# EAGLE design ESC (EAGLE 5.11)
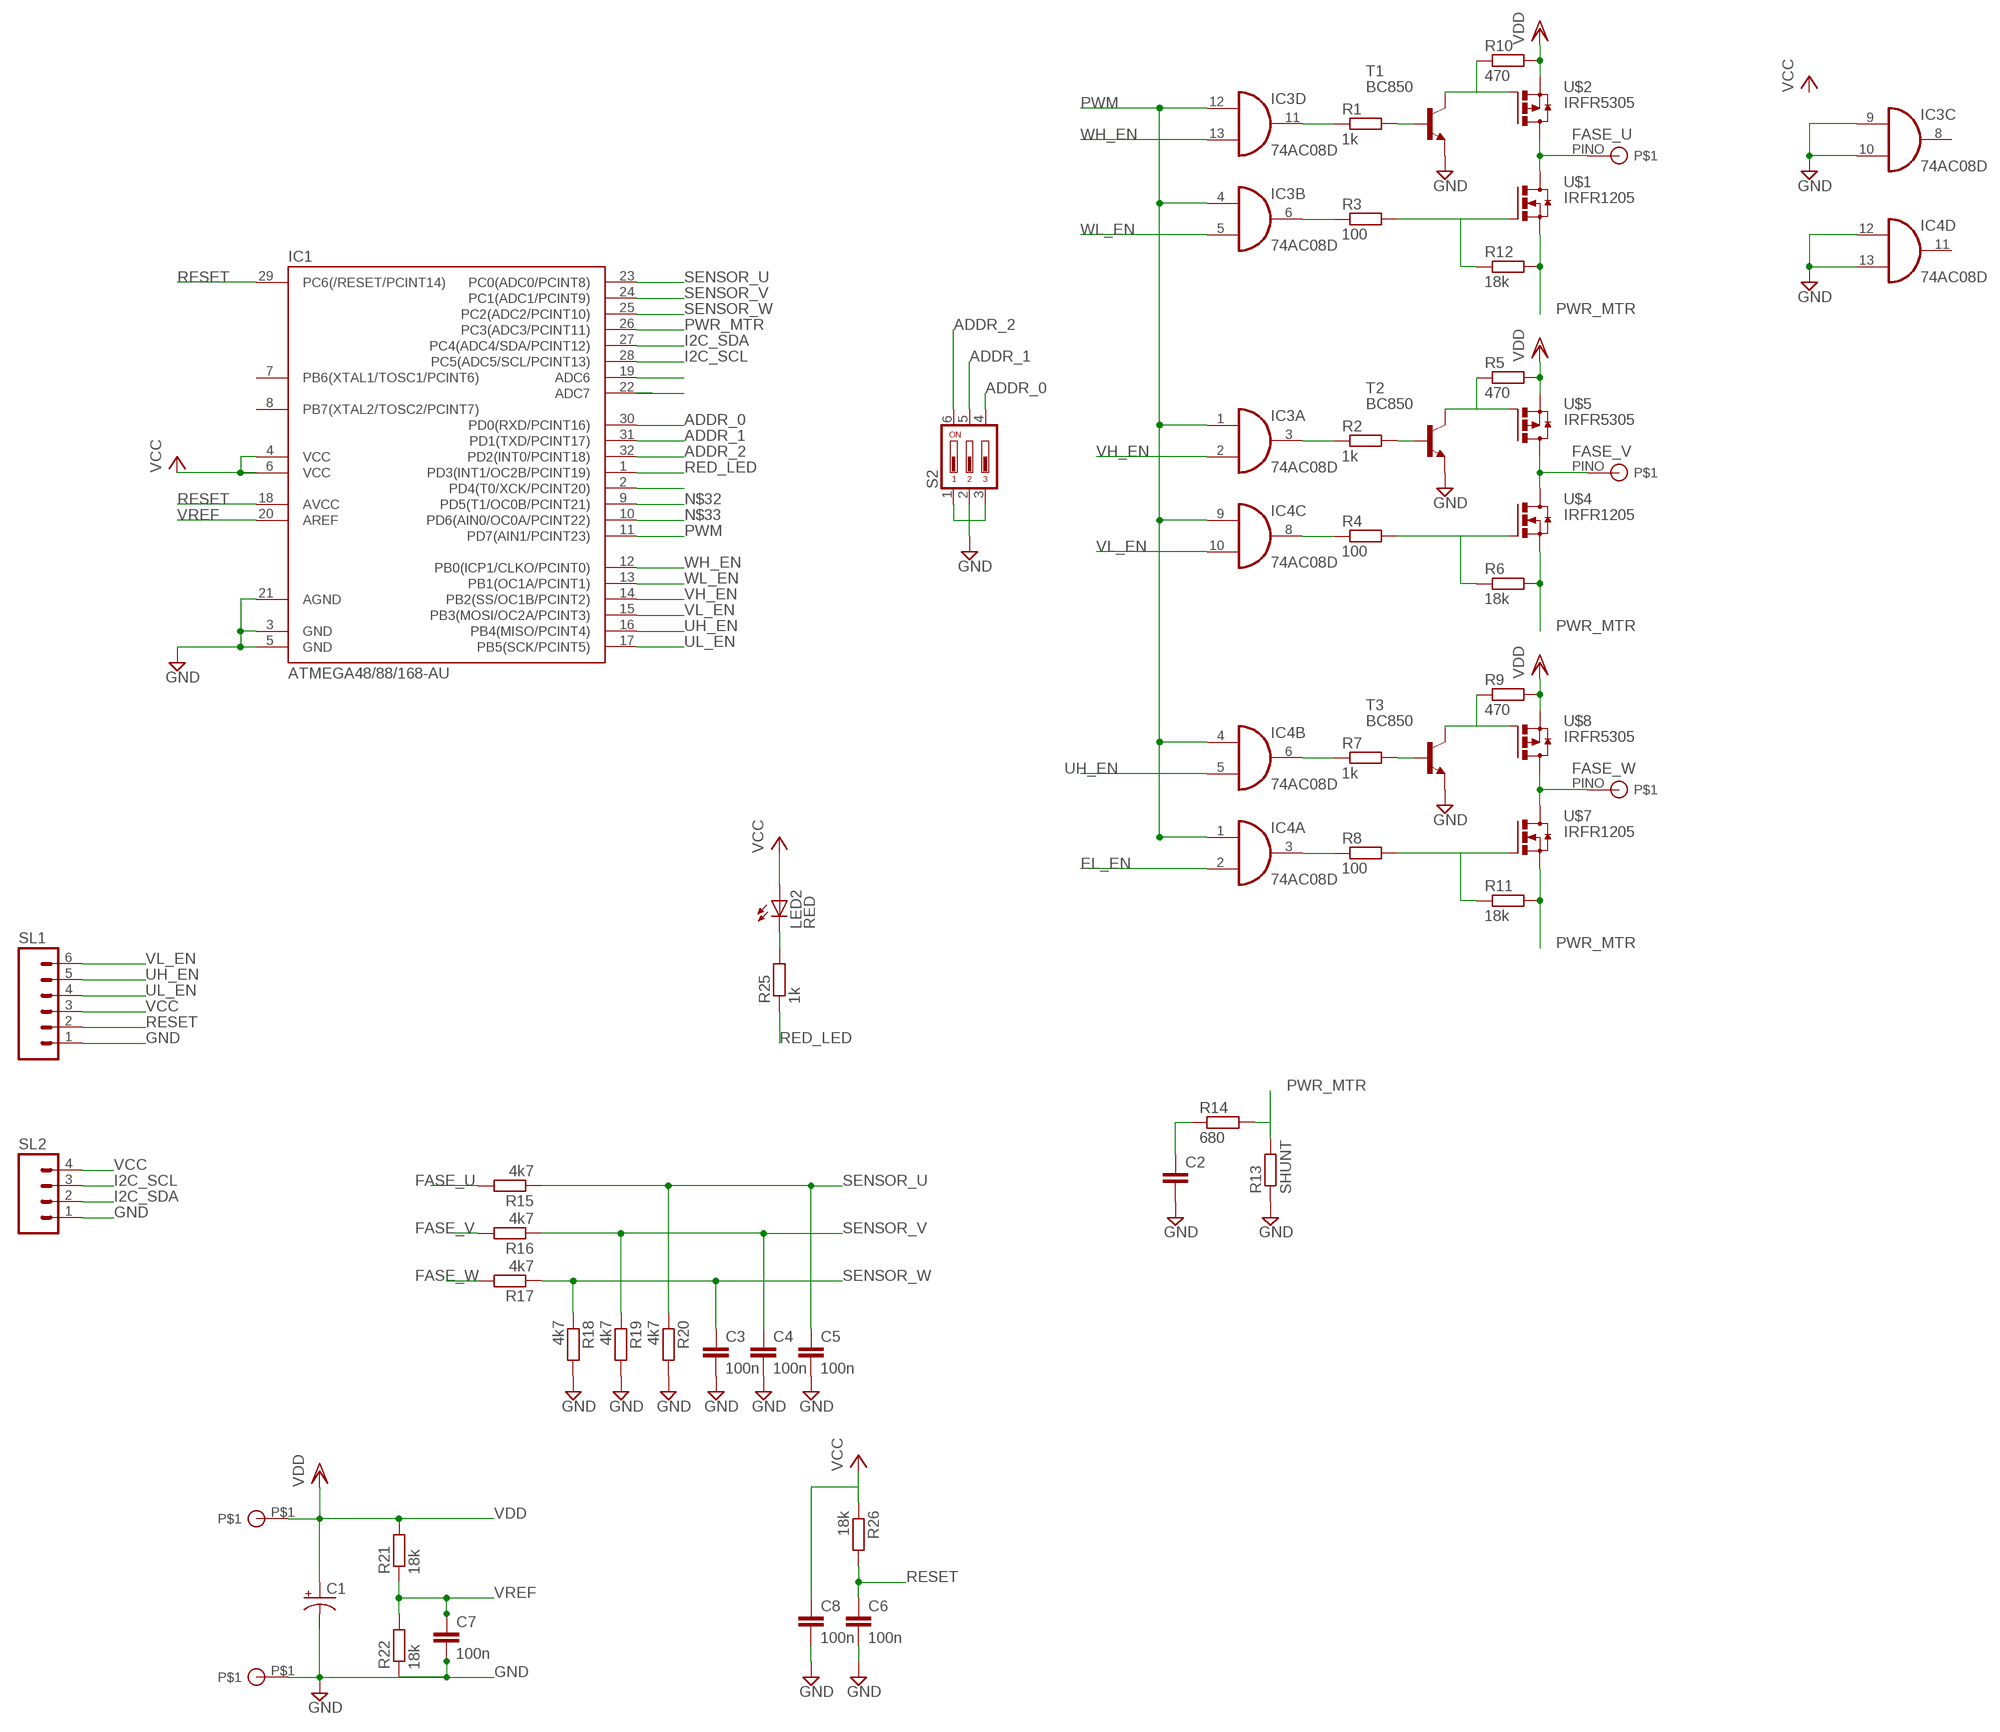
[diagram p0: schematic, sheet 1]

## Parts
BATTERY+  Battery+  BATTERY_CONNECTOR  [BATTERY_CONNECTOR]
C1  CPOL-USE5-8.5  [E5-8,5]
C2  C-EUC0805  [C0805]
C3  100n  C-EUC0805  [C0805]
C4  100n  C-EUC0805  [C0805]
C5  100n  C-EUC0805  [C0805]
C6  100n  C-EUC0805  [C0805]
C7  100n  C-EUC0805  [C0805]
C8  100n  C-EUC0805  [C0805]
IC1  ATMEGA48/88/168-AU  [TQFP32-08]
IC3  74AC08D  [SO14]
IC4  74AC08D  [SO14]
LED2  RED  LEDLSU260  [LSU260]
R1  1k  R-EU_R0805  [R0805]
R2  1k  R-EU_M0805  [M0805]
R3  100  R-EU_M0805  [M0805]
R4  100  R-EU_M0805  [M0805]
R5  470  R-EU_M0805  [M0805]
R6  18k  R-EU_M0805  [M0805]
R7  1k  R-EU_M0805  [M0805]
R8  100  R-EU_M0805  [M0805]
R9  470  R-EU_M0805  [M0805]
R10  470  R-EU_M0805  [M0805]
R11  18k  R-EU_M0805  [M0805]
R12  18k  R-EU_R0805  [R0805]
R13  SHUNT  R-EU_0204/2V  [0204V]
R14  680  R-EU_M0805  [M0805]
R15  4k7  R-EU_M0805  [M0805]
R16  4k7  R-EU_M0805  [M0805]
R17  4k7  R-EU_M0805  [M0805]
R18  4k7  R-EU_M0805  [M0805]
R19  4k7  R-EU_M0805  [M0805]
R20  4k7  R-EU_M0805  [M0805]
R21  18k  R-EU_M0805  [M0805]
R22  18k  R-EU_M0805  [M0805]
R25  1k  R-EU_R0805  [R0805]
R26  18k  R-EU_M0805  [M0805]
S2  DIP03YL  [DIP03YL]
SL1  M06  [06P]
SL2  M04  [04P]
T1  BC850  [SOT23]
T2  BC850  [SOT23]
T3  BC850  [SOT23]
U$1  IRFR1205  [DPAK]
U$2  IRFR5305  [DPAK]
U$3  MOTOR_CONNECTOR  [MOTOR_CONNECTOR]
U$4  IRFR1205  [DPAK]
U$5  IRFR5305  [DPAK]
U$6  MOTOR_CONNECTOR  [MOTOR_CONNECTOR]
U$7  IRFR1205  [DPAK]
U$8  IRFR5305  [DPAK]
U$9  MOTOR_CONNECTOR  [MOTOR_CONNECTOR]
U$11  BATTERY_CONNECTOR  [BATTERY_CONNECTOR]

## Nets
ADDR_0: IC1.30(PD0(RXD/PCINT16)) S2.4
ADDR_1: IC1.31(PD1(TXD/PCINT17)) S2.5
ADDR_2: IC1.32(PD2(INT0/PCINT18)) S2.6
EL_EN: IC4.2(A:I1)
FASE_U: R15.2 U$1.4(D) U$2.4(D) U$3.PINO
FASE_V: R16.2 U$4.4(D) U$5.4(D) U$6.PINO
FASE_W: R17.2 U$7.4(D) U$8.4(D) U$9.PINO
GND: C1.- C2.2 C3.2 C4.2 C5.2 C6.2 C7.2 C8.2 IC1.3(GND) IC1.5(GND) IC1.21(AGND) IC3.9(C:I0) IC3.10(C:I1) IC4.12(D:I0) IC4.13(D:I1) R13.1 R18.2 R19.2 R20.2 R22.1 S2.1 S2.2 S2.3 SL1.1 SL2.1 T1.2(E) T2.2(E) T3.2(E) U$11.P$1
I2C_SCL: IC1.28(PC5(ADC5/SCL/PCINT13)) SL2.3
I2C_SDA: IC1.27(PC4(ADC4/SDA/PCINT12)) SL2.2
N$1: R1.2 T1.1(B)
N$2: R10.1 T1.3(C) U$2.1(G)
N$3: R3.2 R12.1 U$1.1(G)
N$5: R2.2 T2.1(B)
N$6: R5.1 T2.3(C) U$5.1(G)
N$7: R4.2 R6.1 U$4.1(G)
N$8: LED2.K(C) R25.2
N$9: R7.2 T3.1(B)
N$10: R9.1 T3.3(C) U$8.1(G)
N$11: R8.2 R11.1 U$7.1(G)
N$12: IC3.11(D:O) R1.1
N$13: C2.1 R14.1
N$14: IC3.6(B:O) R3.1
N$15: IC3.3(A:O) R2.1
N$16: IC4.8(C:O) R4.1
N$17: IC4.6(B:O) R7.1
N$18: IC4.3(A:O) R8.1
N$25: IC1.19(ADC6)
N$26: IC1.22(ADC7)
N$31: IC1.2(PD4(T0/XCK/PCINT20))
N$32: IC1.9(PD5(T1/OC0B/PCINT21))
N$33: IC1.10(PD6(AIN0/OC0A/PCINT22))
PWM: IC1.11(PD7(AIN1/PCINT23)) IC3.1(A:I0) IC3.4(B:I0) IC3.12(D:I0) IC4.1(A:I0) IC4.4(B:I0) IC4.9(C:I0)
PWR_MTR: IC1.26(PC3(ADC3/PCINT11)) R6.2 R11.2 R12.2 R13.2 R14.2 U$1.3(S) U$4.3(S) U$7.3(S)
RED_LED: IC1.1(PD3(INT1/OC2B/PCINT19)) R25.1
RESET: C6.1 IC1.29(PC6(/RESET/PCINT14)) R26.2 SL1.2
SENSOR_U: C5.1 IC1.23(PC0(ADC0/PCINT8)) R15.1 R20.1
SENSOR_V: C4.1 IC1.24(PC1(ADC1/PCINT9)) R16.1 R19.1
SENSOR_W: C3.1 IC1.25(PC2(ADC2/PCINT10)) R17.1 R18.1
UH_EN: IC1.16(PB4(MISO/PCINT4)) IC4.5(B:I1) SL1.5
UL_EN: IC1.17(PB5(SCK/PCINT5)) SL1.4
VCC: C8.1 IC1.4(VCC) IC1.6(VCC) LED2.A R26.1 SL1.3 SL2.4
VDD: BATTERY+.P$1 C1.+ R5.2 R9.2 R10.2 R21.2 U$2.3(S) U$5.3(S) U$8.3(S)
VH_EN: IC1.14(PB2(SS/OC1B/PCINT2)) IC3.2(A:I1)
VL_EN: IC1.15(PB3(MOSI/OC2A/PCINT3)) IC4.10(C:I1) SL1.6
VREF: C7.1 IC1.20(AREF) R21.1 R22.2
WH_EN: IC1.12(PB0(ICP1/CLKO/PCINT0)) IC3.13(D:I1)
WL_EN: IC1.13(PB1(OC1A/PCINT1)) IC3.5(B:I1)
Unconnected: IC1.7(PB6(XTAL1/TOSC1/PCINT6)) IC1.8(PB7(XTAL2/TOSC2/PCINT7)) IC1.18(AVCC) IC3.8(C:O) IC4.11(D:O)

## Power pins joined to a net without a drawn wire
GND: IC3.7(P:GND) IC4.7(P:GND)
VCC: IC3.14(P:VCC) IC4.14(P:VCC)

## Library data of the parts
BATTERY+ U$11 = ESC:BATTERY_CONNECTOR
C1 = rcl:CPOL-US: POLARIZED CAPACITOR, American symbol
C2-C8 = rcl:C-EU: CAPACITOR, European symbol
IC1 = atmega8:ATMEGA48/88/168
IC3 IC4 = 74xx-eu:74*08: Quad 2-input AND gate
LED2 = led:LED: LED OSRAM: - CHIPLED LG R971, LG N971, LY N971, LG Q971, LY Q971, LO R971, LY R971 LH N974, LH R974 LS Q976, LO Q976, LY Q976 LO Q996 - Hyper CHIPLED LW Q18S LB Q993, LB Q99A, LB R99A - SideLED LS A670, LO A670, LY A670, LG A670, LP A670 LB A673, LV A673, LT A673, LW A673 LH A674 LY A675 LS A676, LA A676, LO A676, LY A676, LW A676 LS A679, LY A679, LG A679 - Hyper Micro SIDELED® LS Y876, LA Y876, LO Y876, LY Y876 LT Y87S - SmartLED LW L88C, LW L88S LB L89C, LB L89S, LG L890 LS L89K, LO L89K, LY L89K LS L896, LA L896, LO L896, LY L896 - TOPLED LS T670, LO T670, LY T670, LG T670, LP T670 LSG T670, LSP T670, LSY T670, LOP T670, LYG T670 LG T671, LOG T671, LSG T671 LB T673, LV T673, LT T673, LW T673 LH T674 LS T676, LA T676, LO T676, LY T676, LB T676, LH T676, LSB T676, LW T676 LB T67C, LV T67C, LT T67C, LS T67K, LO T67K, LY T67K, LW E67C LS E67B, LA E67B, LO E67B, LY E67B, LB E67C, LV E67C, LT E67C LW T67C LS T679, LY T679, LG T679 LS T770, LO T770, LY T770, LG T770, LP T770 LB T773, LV T773, LT T773, LW T773 LH T774 LS E675, LA E675, LY E675, LS T675 LS T776, LA T776, LO T776, LY T776, LB T776 LHGB T686 LT T68C, LB T68C - Hyper Mini TOPLED® LB M676 - Mini TOPLED Santana® LG M470 LS M47K, LO M47K, LY M47K Source: http://www.osram.convergy.de LUXEON: - LUMILED® LXK2-PW12-R00, LXK2-PW12-S00, LXK2-PW14-U00, LXK2-PW14-V00 LXK2-PM12-R00, LXK2-PM12-S00, LXK2-PM14-U00 LXK2-PE12-Q00, LXK2-PE12-R00, LXK2-PE12-S00, LXK2-PE14-T00, LXK2-PE14-U00 LXK2-PB12-K00, LXK2-PB12-L00, LXK2-PB12-M00, LXK2-PB14-N00, LXK2-PB14-P00, LXK2-PB14-Q00 LXK2-PR12-L00, LXK2-PR12-M00, LXK2-PR14-Q00, LXK2-PR14-R00 LXK2-PD12-Q00, LXK2-PD12-R00, LXK2-PD12-S00 LXK2-PH12-R00, LXK2-PH12-S00 LXK2-PL12-P00, LXK2-PL12-Q00, LXK2-PL12-R00 Source: www.luxeon.com KINGBRIGHT: KA-3528ASYC Source: www.kingbright.com
R1-R12 R14-R22 R25 = rcl:R-EU_: RESISTOR, European symbol
R13 R26 = resistor:R-EU_: RESISTOR, European symbol
S2 = switch-dil:DIP03YL: DIL/CODE SWITCH; OC_FARNELL: unknown; OC_NEWARK: unknown
SL1 = con-amp-quick:M06: AMP QUICK CONNECTOR; OC_FARNELL: unknown; OC_NEWARK: unknown
SL2 = con-amp-quick:M04: AMP QUICK CONNECTOR; OC_FARNELL: unknown; OC_NEWARK: unknown
T1-T3 = transistor:BC850: NPN TRANSISTOR
U$1 U$4 U$7 = ESC:IRFR1205
U$2 U$5 U$8 = ESC:IRFR5305
U$3 U$6 U$9 = ESC:MOTOR_CONNECTOR

## Board
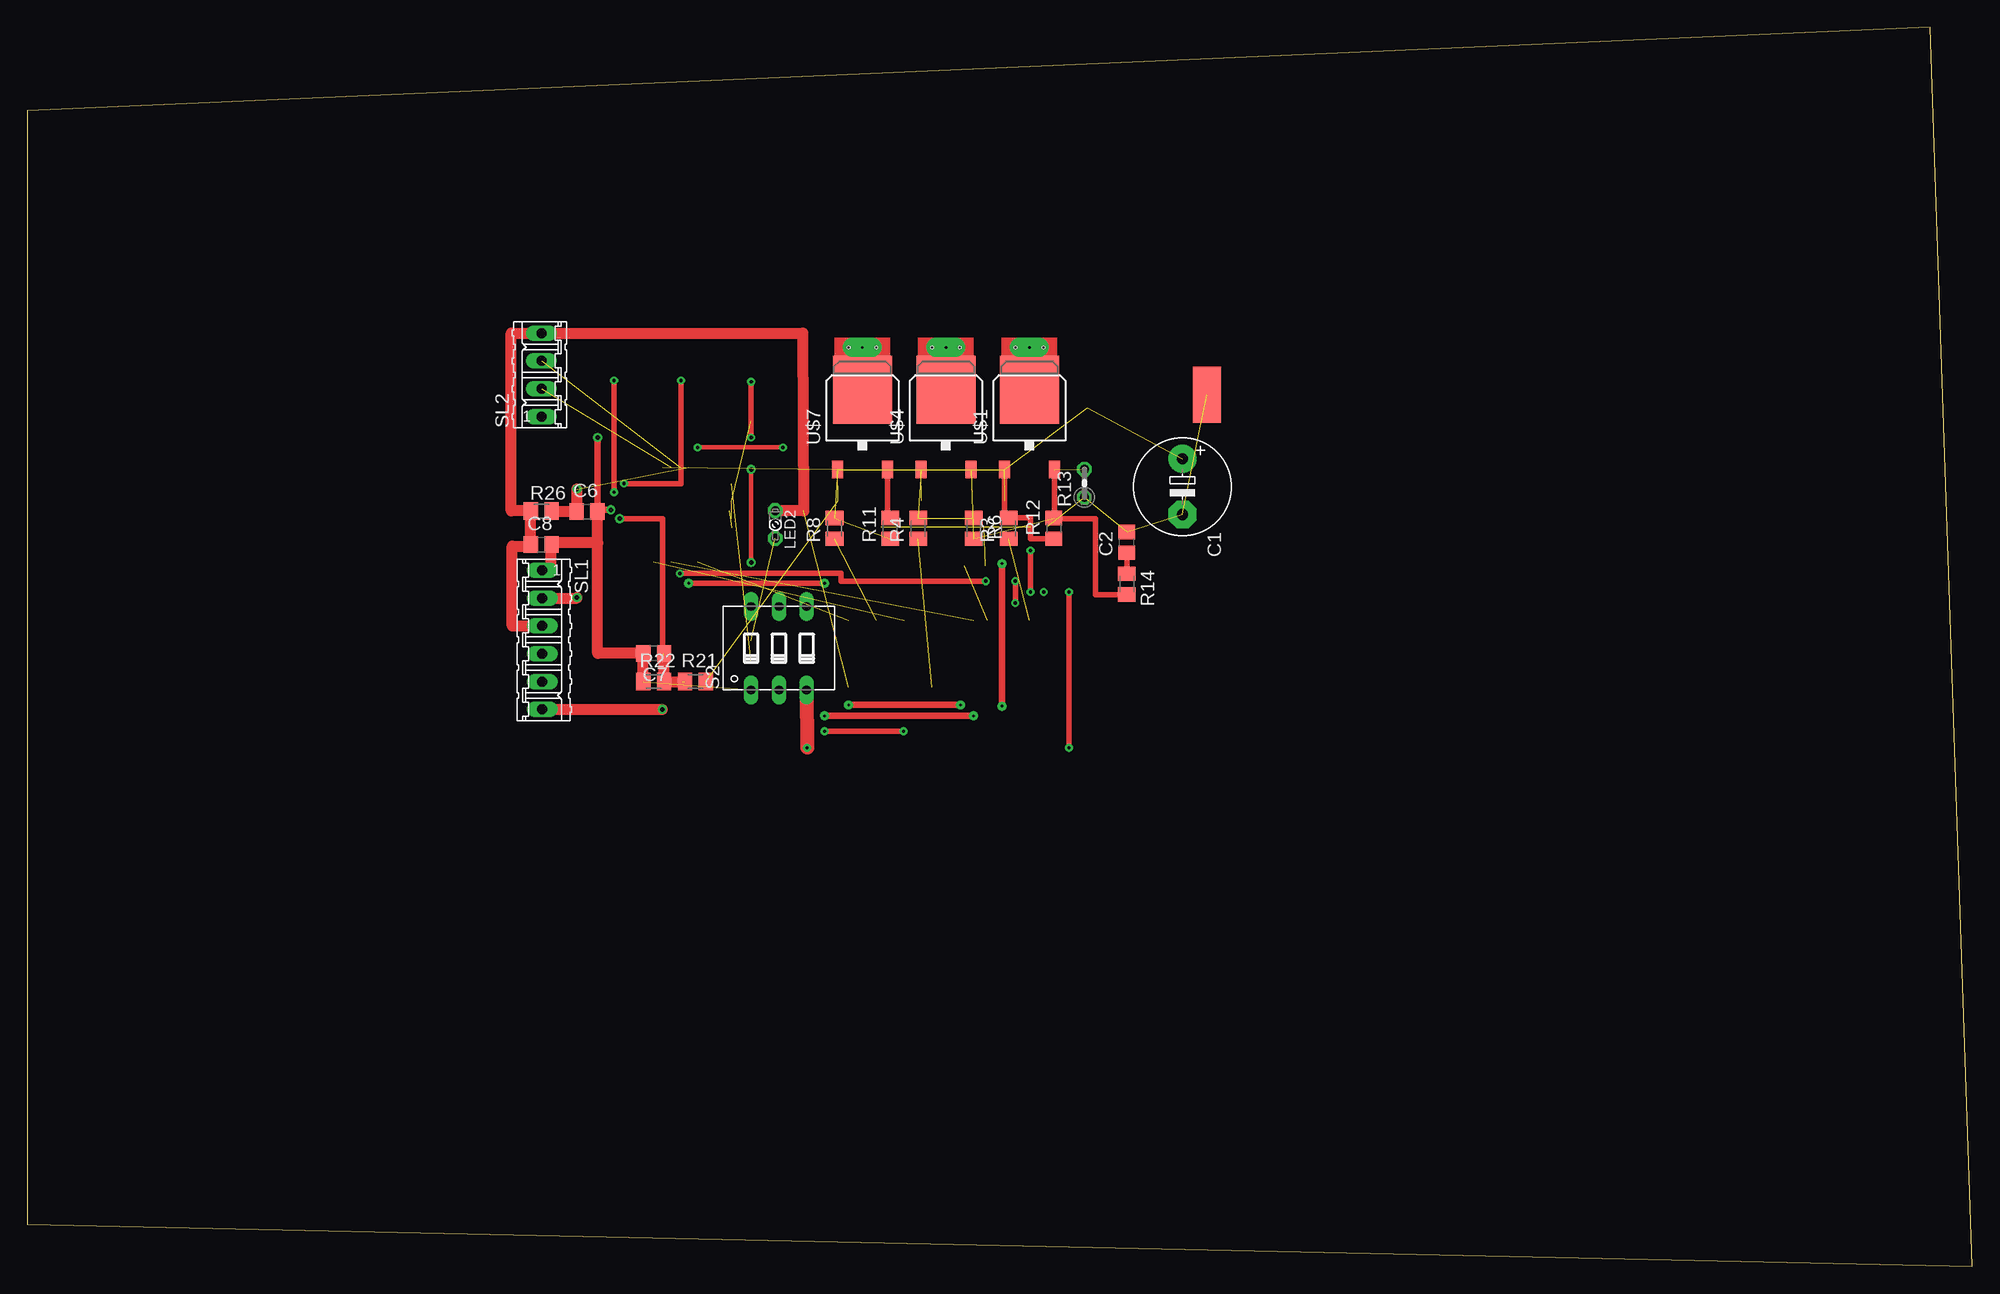
[diagram p1: board, top side]
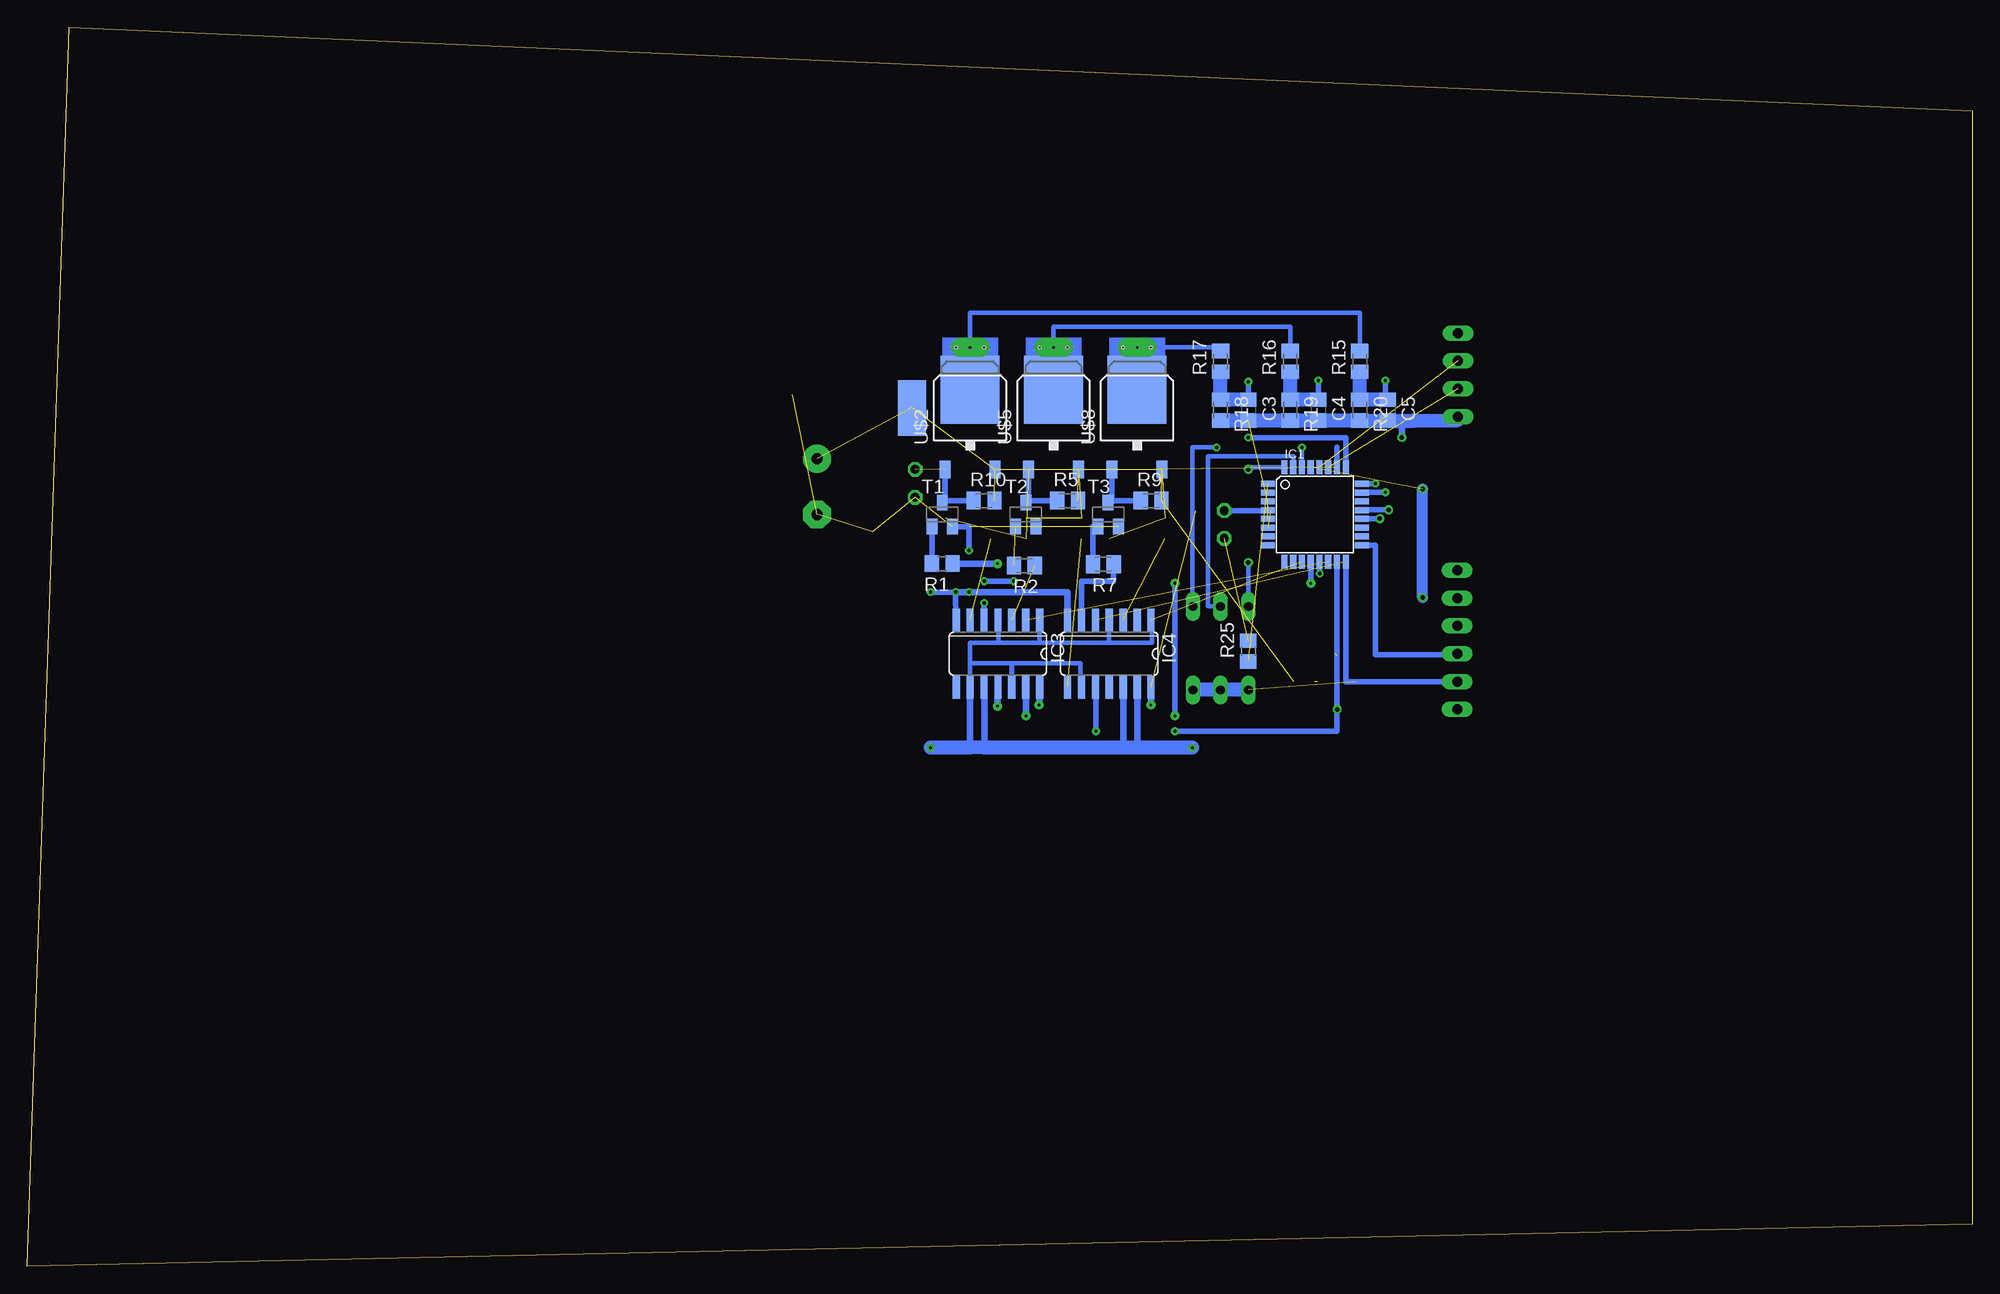
[diagram p2: board, bottom side, seen from below]

Size 177.47 x 113.02 mm. Coordinates in mm from the lower left corner, seen from the top.
Outline: 0,3.81 177.47,0 173.66,113.02 0,105.4 0,3.81
Copper layers (1*16): Top 0.035mm / dielectric 1.5mm / Bottom 0.035mm
Design rules "default": minimum track width 10mil, minimum drill 24mil, track to track 8mil, track to pad 8mil, pad to pad 8mil, via to via 8mil, smd to smd 8mil, copper to edge 40mil, drill to drill 8mil, minimum pad ring 10mil, minimum via ring 8mil, stop-mask expansion 4mil, vias tented up to drill 0mil, thermal gap 10mil

### Footprints (pad centres in the part's own frame; a part is rotated, then mirrored left to right if it is on the bottom)
BATTERY_CONNECTOR = smd 5.08 x 2.54: P$1 0,0
E5-8,5 = drill 1.016 pad 2.54 round: + -2.54,0 | drill 1.016 pad 2.54 octagon: - 2.54,0
C0805 = smd 1.3 x 1.5: 1 -0.95,0; 2 0.95,0
TQFP32-08 = smd 1.27 x 0.559: 1 -4.293,2.8; 2 -4.293,2; 3 -4.293,1.2; 4 -4.293,0.4; 5 -4.293,-0.4; 6 -4.293,-1.2; 7 -4.293,-2; 8 -4.293,-2.8; 17 4.293,-2.8; 18 4.293,-2; 19 4.293,-1.2; 20 4.293,-0.4; 21 4.293,0.4; 22 4.293,1.2; 23 4.293,2; 24 4.293,2.8 | smd 0.559 x 1.27: 9 -2.8,-4.293; 10 -2,-4.293; 11 -1.2,-4.293; 12 -0.4,-4.293; 13 0.4,-4.293; 14 1.2,-4.293; 15 2,-4.293; 16 2.8,-4.293; 25 2.8,4.293; 26 2,4.293; 27 1.2,4.293; 28 0.4,4.293; 29 -0.4,4.293; 30 -1.2,4.293; 31 -2,4.293; 32 -2.8,4.293
SO14 = smd 0.66 x 2.032: 1 -3.81,-3.073; 2 -2.54,-3.073; 3 -1.27,-3.073; 4 0,-3.073; 5 1.27,-3.073; 6 2.54,-3.073; 7 3.81,-3.073; 8 3.81,3.073; 9 2.54,3.073; 10 1.27,3.073; 11 0,3.073; 12 -1.27,3.073; 13 -2.54,3.073; 14 -3.81,3.073
LSU260 = drill 0.813 octagon: A -1.27,0; K 1.27,0
R0805 = smd 1.3 x 1.5: 1 -0.95,0; 2 0.95,0
M0805 = smd 1.3 x 1.6: 1 -0.95,0; 2 0.95,0
0204V = drill 0.813 octagon: 1 -1.27,0; 2 1.27,0
DIP03YL = drill 0.813 long: 1 -2.54,-3.81; 2 0,-3.81; 3 2.54,-3.81; 4 2.54,3.81; 5 0,3.81; 6 -2.54,3.81
06P = drill 0.914 long: 1 -6.35,0; 2 -3.81,0; 3 -1.27,0; 4 1.27,0; 5 3.81,0; 6 6.35,0
04P = drill 0.914 long: 1 -3.81,0; 2 -1.27,0; 3 1.27,0; 4 3.81,0
SOT23 = smd 1 x 1.4: 1 -0.95,-1.1; 2 0.95,-1.1; 3 0,1.1
DPAK = smd 1 x 1.6: 1 -2.28,-4.8; 3 2.28,-4.8 | smd 5.4 x 6.2: 4 0,2.5
MOTOR_CONNECTOR = drill 0.254 pad 1.778 long: PINO 0,0 | hole 0.254: -1.27,0; 1.27,0

### Placement (x,y rotation side)
BATTERY+  96.74,78.31 90 bottom
C1  105.41,71.12 270 top
C2  100.33,66.04 90 top
C3  66.04,78.1 270 bottom
C4  59.69,78.1 270 bottom
C5  53.34,78.1 270 bottom
C6  51.07,68.85 0 top
C7  57.15,55.88 180 top
C8  46.89,65.84 0 top
IC1  59.96,68.58 0 bottom
IC3  88.9,55.88 180 bottom
IC4  78.74,55.88 180 bottom
LED2  68.25,67.67 270 top
R1  93.98,64.1 180 bottom
R2  86.48,63.92 180 bottom
R3  89.53,67.31 90 top
R4  81.28,67.31 90 top
R5  82.55,69.85 0 bottom
R6  86.36,67.31 270 top
R7  79.28,64.04 180 bottom
R8  73.66,67.31 90 top
R9  74.93,69.85 0 bottom
R10  90.17,69.85 0 bottom
R11  78.74,67.31 90 top
R12  93.68,67.31 90 top
R13  96.45,71.42 90 top
R14  100.33,62.23 270 top
R15  55.88,82.55 90 bottom
R16  62.23,82.55 90 bottom
R17  68.58,82.55 90 bottom
R18  68.58,78.1 270 bottom
R19  62.23,78.1 270 bottom
R20  55.88,78.1 270 bottom
R21  60.96,53.34 0 top
R22  57.15,53.34 0 top
R25  66.05,56.12 90 bottom
R26  46.89,68.88 0 top
S2  68.58,56.38 0 top
SL1  46.99,57.15 270 top
SL2  46.91,81.32 90 top
T1  93.98,68.58 0 bottom
T2  86.36,68.58 0 bottom
T3  78.84,68.58 0 bottom
U$1  91.44,77.47 0 top
U$2  91.44,77.47 0 bottom
U$3  91.44,83.82 0 top
U$4  83.82,77.47 0 top
U$5  83.82,77.47 0 bottom
U$6  83.82,83.82 0 top
U$7  76.2,77.47 0 top
U$8  76.2,77.47 0 bottom
U$9  76.2,83.82 0 top
U$11  107.64,79.51 270 top

### Tracks (layer width: path | path; a pad name or v marks a point on that pad's centre or on a via)
ADDR_0  (via drill 0.3, 0.3 pad 0.25)
  Top 0.406: v68.95,74.7 v61.15,74.7
  Bottom 0.406: S2.4 71.15,60.19 71.15,74.7 v68.95,74.7 | v61.15,74.7 61.16,73.9 IC1.30
ADDR_1
  Bottom 0.406: S2.5 69.75,60.19 69.75,73.9 61.95,73.9 61.95,73.1 61.96,73.1 IC1.31
ADDR_2  (via drill 0.4 pad 0.25)
  Top 0.406: v66.05,64.2 v66.05,72.7
  Bottom 0.406: IC1.32 66.05,72.87 v66.05,72.7 | v66.05,64.2 v66.04,64.2 S2.6
FASE_U
  Top 0.406: U$3.PINO U$1.4
  Bottom 0.406: R15.2 55.88,87 91.44,87 U$3.PINO U$1.4
FASE_V
  Top 0.406: U$6.PINO U$4.4
  Bottom 0.406: R16.2 62.23,85.72 83.82,85.72 U$6.PINO U$4.4
FASE_W
  Top 0.406: U$9.PINO U$7.4
  Bottom 0.406: R17.2 68.58,83.82 U$9.PINO U$7.4
GND  (via drill 0.3, 0.3 pad 0.15, 0.4 pad 0.25)  (9 unrouted)
  Top 0.5: v95.05,47.3 v95.05,61.5 | C6.2 52.15,68.85 52.05,69 | v91.55,61.5 v91.55,65.3
  Top 0.61: v52.05,75.6 52.05,69 v53.25,69
  Top 1: C6.2 52.05,68.85 52.05,66 | 52.05,66 47.94,66 C8.2 47.75,66.04 47.75,63.5 47.15,63.5 47.15,63.6 46.99,63.6 SL1.1 | 52.05,66 52.05,55.9 56.35,55.9 56.35,55.6 56.2,55.6 C7.2 R22.1 56.05,53.34 56.05,53.3 56.15,53.3 56.15,53.5
  Top 1.27: S2.3 v71.15,47.3
  Bottom 0.406: R20.2 51.95,77.16 51.95,77.1
  Bottom 0.5: v95.05,61.5 v92.75,61.5 IC3.7 | v53.25,69 55.57,69 IC1.21 | T1.2 91.55,67.48 v91.55,65.3
  Bottom 0.61: IC3.9 91.45,47.3 | v92.75,61.5 v91.55,61.5 82.55,61.5 IC4.7 | IC4.13 76.15,52.81 76.15,47.3 | IC3.10 90.15,52.81 90.15,47.32 | IC4.12 77.45,52.81 77.45,47.3 | 51.95,77.1 52.05,77.1 v52.05,75.6
  Bottom 1.27: R18.2 C3.2 R19.2 C4.2 R20.2 C5.2 | C5.2 53.34,77.1 | SL2.1 46.95,77.19 50.95,77.16 C5.2 | S2.1 S2.2 S2.3 | v71.15,47.3 76.15,47.3 77.45,47.3 90.05,47.3 90.15,47.32 91.45,47.3 v95.05,47.3
I2C_SCL  (1 unrouted)
I2C_SDA  (1 unrouted)
N$1
  Bottom 0.5: T1.1 R1.2
N$2
  Bottom 0.5: R10.1 93.98,69.85 T1.3 93.72,69.68 U$2.1
N$3
  Top 0.5: R12.1 91.55,66.36 91.55,68.3 89.53,68.3 R3.2 89.16,68.26 U$1.1
N$5  (1 unrouted)
N$6
  Bottom 0.5: R5.1 86.35,69.85 86.35,69.8 86.36,69.8 T2.3 86.1,69.68 U$5.1
N$7  (2 unrouted)
N$8  (1 unrouted)
N$9
  Bottom 0.5: R7.2 80.25,67.5 79.79,67.5 T3.1
N$10
  Bottom 0.5: R9.1 78.54,69.85 T3.3 78.48,69.68 U$8.1
N$11  (2 unrouted)
N$12  (via drill 0.25 pad 0.81)
  Top 0.61: v88.95,51.1 v88.95,64.1
  Bottom 0.61: IC3.11 88.95,52.81 v88.95,51.1 | v88.95,64.1 R1.1
N$13
  Top 0.5: R14.1 C2.1
N$14  (1 unrouted)
N$15  (1 unrouted)
N$16  (1 unrouted)
N$17
  Bottom 0.5: R7.1 78.35,64.04 78.35,62.5 81.28,62.5 IC4.6
N$18  (1 unrouted)
PWM  (1 unrouted)
  Bottom 0.406: IC4.9 81.35,52.81 81.35,55 87.64,55 IC3.12 87.65,52.81 87.65,55 91.44,55 91.45,53 91.45,56.9 88.85,56.9 | IC3.4 88.9,58.8 88.85,58.8 88.85,56.9 | IC4.4 78.75,56.9 | 78.75,56.9 74.85,56.9 74.85,58.8 74.93,58.8 IC4.1 | 78.75,56.9 85.09,56.9 | 85.09,56.9 IC3.1 | 85.09,56.9 88.85,56.9
PWR_MTR  (5 unrouted)
  Top 0.5: R11.2 78.48,68.26 U$7.3 | R14.2 97.45,61.28 97.45,68.2 93.98,68.2 R12.2 93.72,68.26 U$1.3
  Bottom 0.5: IC1.26 57.95,74.7
RED_LED  (1 unrouted)
RESET  (via drill 0.4 pad 0.25)  (1 unrouted)
  Top 1: R26.2 47.84,68.9 48.15,68.9 48.15,68.85 C6.1 50.12,70.9 v50.15,70.9 | SL1.2 50.15,60.96 v50.15,61
  Bottom 1: v50.15,61 v50.15,70.9
SENSOR_U  (via drill 0.3)
  Top 0.5: v53.55,70.6 v53.55,80.8
  Bottom 0.5: v53.55,80.8 53.55,79.05 | v53.55,70.6 55.67,70.6 IC1.23
  Bottom 1.27: R15.1 R20.1 53.55,79.05 C5.1
SENSOR_V  (via drill 0.3)
  Top 0.5: v59.65,80.8 59.65,71.4 v54.45,71.4
  Bottom 0.5: C4.1 59.65,79.05 v59.65,80.8 | v54.45,71.4 55.67,71.4 IC1.24
  Bottom 1.27: R16.1 R19.1 C4.1
SENSOR_W  (via drill 0.3)
  Top 0.5: v66.05,75.6 v66.05,80.7
  Bottom 0.406: 57.15,74.2 57.16,74.3
  Bottom 0.5: IC1.25 57.16,74.2 57.15,74.2 57.15,75.6 v66.05,75.6 | v66.05,80.7 C3.1
  Bottom 1.27: R17.1 R18.1 C3.1
UH_EN  (1 unrouted)
  Bottom 0.5: SL1.5 57.16,53.34 IC1.16
UL_EN
  Bottom 0.5: IC1.17 54.45,65.78 54.45,55.8 46.99,55.8 SL1.4
VCC  (via drill 0.25 pad 0.81)  (2 unrouted)
  Top 0.61: v74.95,51.2 v85.15,51.2
  Top 1: R26.1 45.94,68.98 | R26.1 C8.1 45.94,66 46.15,66 46.15,65.7 44.25,65.7 44.25,58.42 SL1.3 | SL2.4 44.15,85.13 44.15,68.9 45.94,68.9 R26.1
  Top 1.016: SL2.4 70.75,85.13 70.85,68.9 68.55,68.9 LED2.A
  Bottom 0.5: LED2.A 64.05,68.94 64.15,69 | 64.15,69 64.05,69 | 64.15,69 64.25,69 IC1.4
  Bottom 0.61: IC4.14 74.95,52.81 v74.95,51.2 | v85.15,51.2 85.09,51.2 IC3.14
VDD  (8 unrouted)
VH_EN  (1 unrouted)
VL_EN  (via drill 0.3, 0.4 pad 0.25)
  Top 0.5: v72.75,48.8 v79.95,48.8
  Top 1: SL1.6 v57.95,50.8
  Bottom 0.5: IC1.15 57.96,51.4 v57.95,50.8 57.95,48.8 v72.75,48.8 | IC4.10 79.95,52.81 v79.95,48.8
VREF  (via drill 0.4 pad 0.25)  (2 unrouted)
  Top 0.5: v54.05,68.2 57.95,68.2 57.95,55.7
  Top 1: C7.1 R22.2 59.75,53.34 59.75,53.4
  Bottom 0.5: IC1.20 54.05,68.18 v54.05,68.2
WH_EN  (via drill 0.25 pad 0.81)
  Top 0.5: v60.35,62.3 v72.75,62.3
  Top 0.61: v72.75,50.2 v86.35,50.2
  Bottom 0.5: v72.75,62.3 v72.75,50.2 | v60.35,62.3 60.36,63.2 IC1.12
  Bottom 0.61: IC3.13 v86.35,50.2
WL_EN  (via drill 0.3)
  Top 0.5: v90.15,62.5 v90.15,60.5 | v87.45,62.5 74.25,62.5 74.25,63.2 v59.55,63.2
  Bottom 0.5: IC3.5 90.15,58.95 v90.15,60.5 | v87.45,62.5 v90.15,62.5 | v59.55,63.2 59.56,63.5 IC1.13